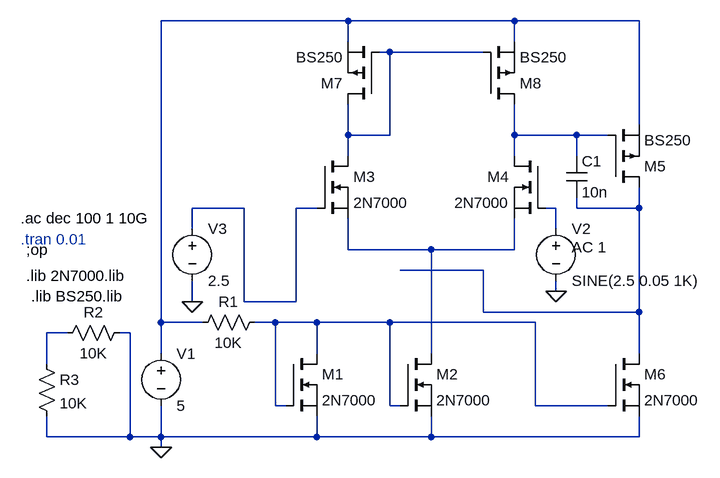
[diagram p0: schematic Pruebas OpAmp.asc]
Pruebas OpAmp.asc, the LTspice schematic file:
Version 4.1
SHEET 1 1816 680
WIRE 1008 -496 720 -496
WIRE 1264 -496 1008 -496
WIRE 1456 -496 1264 -496
WIRE 1008 -464 1008 -496
WIRE 1264 -464 1264 -496
WIRE 1072 -448 1056 -448
WIRE 1216 -448 1072 -448
WIRE 1456 -336 1456 -496
WIRE 1008 -320 1008 -368
WIRE 1072 -320 1072 -448
WIRE 1072 -320 1008 -320
WIRE 1264 -320 1264 -368
WIRE 1360 -320 1264 -320
WIRE 1408 -320 1360 -320
WIRE 1008 -288 1008 -320
WIRE 1264 -288 1264 -320
WIRE 1360 -288 1360 -320
WIRE 848 -208 768 -208
WIRE 960 -208 928 -208
WIRE 1328 -208 1312 -208
WIRE 1360 -208 1360 -224
WIRE 1456 -208 1456 -240
WIRE 1456 -208 1360 -208
WIRE 768 -176 768 -208
WIRE 1328 -176 1328 -208
WIRE 1008 -144 1008 -192
WIRE 1136 -144 1008 -144
WIRE 1264 -144 1264 -192
WIRE 1264 -144 1136 -144
WIRE 1216 -112 1088 -112
WIRE 1328 -80 1328 -96
WIRE 768 -64 768 -96
WIRE 848 -64 848 -208
WIRE 928 -64 928 -208
WIRE 928 -64 848 -64
WIRE 1216 -48 1216 -112
WIRE 1456 -48 1456 -208
WIRE 1456 -48 1216 -48
WIRE 720 -32 720 -496
WIRE 784 -32 720 -32
WIRE 896 -32 864 -32
WIRE 960 -32 896 -32
WIRE 1072 -32 960 -32
WIRE 1296 -32 1072 -32
WIRE 576 -16 544 -16
WIRE 672 -16 656 -16
WIRE 720 16 720 -32
WIRE 960 16 960 -32
WIRE 1136 16 1136 -144
WIRE 1456 16 1456 -48
WIRE 544 32 544 -16
WIRE 896 96 896 -32
WIRE 912 96 896 96
WIRE 1072 96 1072 -32
WIRE 1088 96 1072 96
WIRE 1296 96 1296 -32
WIRE 1408 96 1296 96
WIRE 544 144 544 112
WIRE 672 144 672 -16
WIRE 672 144 544 144
WIRE 720 144 720 96
WIRE 720 144 672 144
WIRE 960 144 960 112
WIRE 960 144 720 144
WIRE 1136 144 1136 112
WIRE 1136 144 960 144
WIRE 1456 144 1456 112
WIRE 1456 144 1136 144
WIRE 720 160 720 144
FLAG 720 160 0
FLAG 768 -64 0
FLAG 1328 -80 0
DATAFLAG 1456 -160 ""
DATAFLAG 1344 -320 ""
SYMBOL voltage 768 -192 R0
WINDOW 123 0 0 Left 0
WINDOW 39 0 0 Left 0
SYMATTR InstName V3
SYMATTR Value 2.5
SYMBOL voltage 720 0 R0
WINDOW 123 0 0 Left 0
WINDOW 39 0 0 Left 0
SYMATTR InstName V1
SYMATTR Value 5
SYMBOL voltage 1328 -192 R0
WINDOW 123 24 44 Left 2
WINDOW 39 0 0 Left 0
SYMATTR Value2 AC 1
SYMATTR InstName V2
SYMATTR Value SINE(2.5 0.05 1K)
SYMBOL nmos 912 16 R0
SYMATTR InstName M1
SYMATTR Value 2N7000
SYMATTR Prefix X
SYMBOL nmos 1088 16 R0
SYMATTR InstName M2
SYMATTR Value 2N7000
SYMATTR Prefix X
SYMBOL nmos 960 -288 R0
SYMATTR InstName M3
SYMATTR Value 2N7000
SYMATTR Prefix X
SYMBOL nmos 1312 -288 M0
SYMATTR InstName M4
SYMATTR Value 2N7000
SYMATTR Prefix X
SYMBOL res 880 -48 R90
WINDOW 0 0 56 VBottom 2
WINDOW 3 32 56 VTop 2
SYMATTR InstName R1
SYMATTR Value 10K
SYMBOL nmos 1408 16 R0
SYMATTR InstName M6
SYMATTR Value 2N7000
SYMATTR Prefix X
SYMBOL pmos 1408 -240 M180
SYMATTR InstName M5
SYMATTR Value BS250
SYMATTR Prefix X
SYMBOL pmos 1056 -368 R180
SYMATTR InstName M7
SYMATTR Value BS250
SYMATTR Prefix X
SYMBOL pmos 1216 -368 M180
SYMATTR InstName M8
SYMATTR Value BS250
SYMATTR Prefix X
SYMBOL res 672 -32 R90
WINDOW 0 0 56 VBottom 2
WINDOW 3 32 56 VTop 2
SYMATTR InstName R2
SYMATTR Value 10K
SYMBOL res 528 16 R0
SYMATTR InstName R3
SYMATTR Value 10K
SYMBOL cap 1344 -288 R0
SYMATTR InstName C1
SYMATTR Value 10n
TEXT 512 -144 Left 2 !;op
TEXT 512 -104 Left 2 !.lib 2N7000.lib
TEXT 504 -192 Left 2 !.ac dec 100 1 10G
TEXT 520 -72 Left 2 !.lib BS250.lib
TEXT 504 -160 Left 2 ;.tran 0.01

The netlist it stands for:
* Pruebas OpAmp.asc
V3 N004 0 2.5
V1 N001 0 5
V2 N005 0 SINE(2.5 0.05 1K) AC 1
X§M1 N008 N008 0 2N7000  ; pins D G S
X§M2 N007 N008 0 2N7000  ; pins D G S
X§M3 N002 N004 N007 2N7000  ; pins D G S
X§M4 N003 N005 N007 2N7000  ; pins D G S
R1 N008 N001 10K
X§M6 N006 N008 0 2N7000  ; pins D G S
X§M5 N006 N003 N001 BS250  ; pins D G S
X§M7 N002 N002 N001 BS250  ; pins D G S
X§M8 N003 N002 N001 BS250  ; pins D G S
R2 0 N009 10K
R3 N009 0 10K
C1 N003 N006 10n
;op
.lib 2N7000.lib
.ac dec 100 1 10G
.lib BS250.lib
* .tran 0.01
.backanno
.end